# EAGLE design tc0xC_proto (EAGLE 9.6.2)

## Sheet 1 of 2
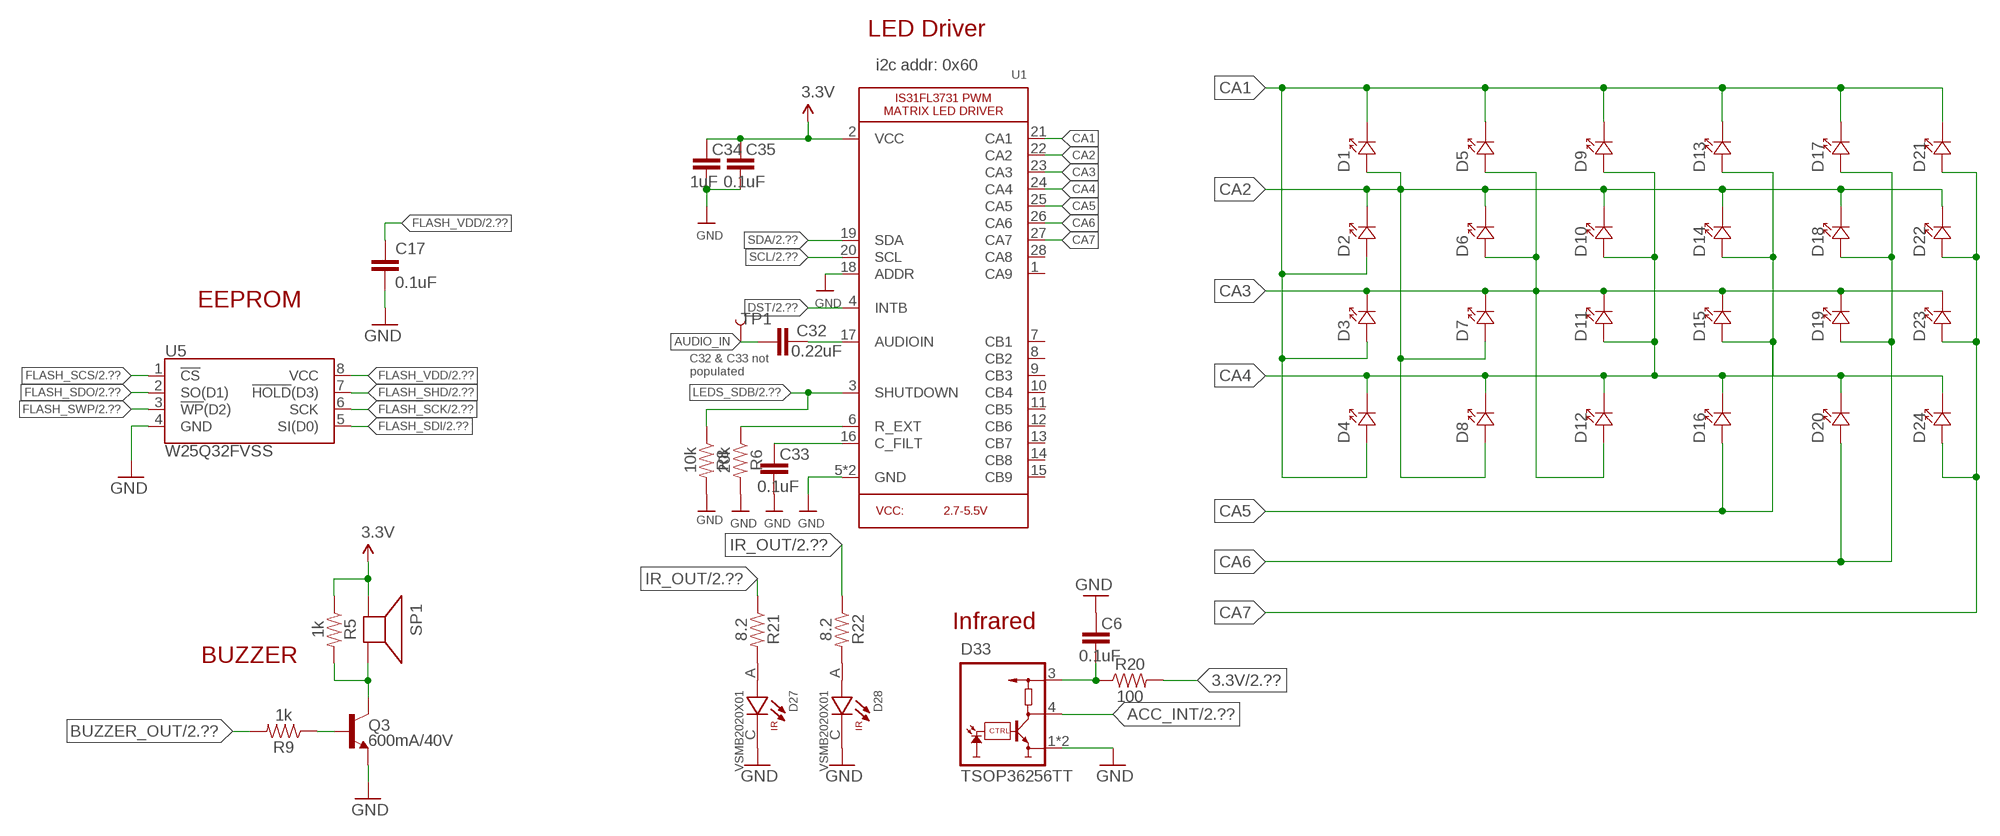
[diagram p0: schematic, sheet 1]

### Parts
C6  0.1uF  10PF-0603-50V-5%  [0603]
C17  0.1uF  0.1UF-0603-25V-(+80/-20%)  [0603]
C32  0.22uF  10PF-0603-50V-5%  [0603]
C33  0.1uF  10PF-0603-50V-5%  [0603]
C34  1uF  10PF-0603-50V-5%  [0603]
C35  0.1uF  10PF-0603-50V-5%  [0603]
D1  LED-603  [SMD-603]
D2  LED-603  [SMD-603]
D3  LED-603  [SMD-603]
D4  LED-603  [SMD-603]
D5  LED-603  [SMD-603]
D6  LED-603  [SMD-603]
D7  LED-603  [SMD-603]
D8  LED-603  [SMD-603]
D9  LED-603  [SMD-603]
D10  LED-603  [SMD-603]
D11  LED-603  [SMD-603]
D12  LED-603  [SMD-603]
D13  LED-603  [SMD-603]
D14  LED-603  [SMD-603]
D15  LED-603  [SMD-603]
D16  LED-603  [SMD-603]
D17  LED-603  [SMD-603]
D18  LED-603  [SMD-603]
D19  LED-603  [SMD-603]
D20  LED-603  [SMD-603]
D21  LED-603  [SMD-603]
D22  LED-603  [SMD-603]
D23  LED-603  [SMD-603]
D24  LED-603  [SMD-603]
D27  VSMB2020X01  [DIO_VSMB2020X01]
D28  VSMB2020X01  [DIO_VSMB2020X01]
D33  TSOP36256TT  [TSOP36256]
Q3  600mA/40V  TRANS_NPN-MMBT2222AL  [SOT23-3]
R5  1k  10KOHM-0603-1/10W-1%  [0603]
R6  20k  10KOHM-0603-1/10W-1%  [0603]
R8  10k  10KOHM-0603-1/10W-1%  [0603]
R9  1k  10KOHM-0603-1/10W-1%  [0603]
R20  100  10KOHM-0603-1/10W-1%  [0603]
R21  8.2  10KOHM-0603-1/10W-1%  [0603]
R22  8.2  10KOHM-0603-1/10W-1%  [0603]
SP1  SPEAKER/PS12  [PS12]
TP1  TEST-POINT3X5  [PAD.03X.05]
U1  IS31FL3731QFN  [QFN-28_4MM_0.4MM]
U5  W25Q32FVSS  [SOIC-8]

### Nets
3.3V: C6.2 C34.1 C35.1 D33.3(VS) R5.1 R20.1 R20.2 SP1.P$1(+) U1.2(VCC) ; also sheet 2
ACC_INT: D33.4(OUT) ; also sheet 2
AUDIO_IN: C32.1 TP1.P$1
BUZZER_OUT: R9.2 ; also sheet 2
CA1: D1.P$2(CATHODE-) D2.P$1(ANODE+) D3.P$1(ANODE+) D4.P$1(ANODE+) D5.P$2(CATHODE-) D9.P$2(CATHODE-) D13.P$2(CATHODE-) D17.P$2(CATHODE-) D21.P$2(CATHODE-) U1.21(CA1)
CA2: D1.P$1(ANODE+) D2.P$2(CATHODE-) D6.P$2(CATHODE-) D7.P$1(ANODE+) D8.P$1(ANODE+) D10.P$2(CATHODE-) D14.P$2(CATHODE-) D18.P$2(CATHODE-) D22.P$2(CATHODE-) U1.22(CA2)
CA3: D3.P$2(CATHODE-) D5.P$1(ANODE+) D6.P$1(ANODE+) D7.P$2(CATHODE-) D11.P$2(CATHODE-) D12.P$1(ANODE+) D15.P$2(CATHODE-) D19.P$2(CATHODE-) D23.P$2(CATHODE-) U1.23(CA3)
CA4: D4.P$2(CATHODE-) D8.P$2(CATHODE-) D9.P$1(ANODE+) D10.P$1(ANODE+) D11.P$1(ANODE+) D12.P$2(CATHODE-) D16.P$2(CATHODE-) D20.P$2(CATHODE-) D24.P$2(CATHODE-) U1.24(CA4)
CA5: D13.P$1(ANODE+) D14.P$1(ANODE+) D15.P$1(ANODE+) D16.P$1(ANODE+) U1.25(CA5)
CA6: D17.P$1(ANODE+) D18.P$1(ANODE+) D19.P$1(ANODE+) D20.P$1(ANODE+) U1.26(CA6)
CA7: D21.P$1(ANODE+) D22.P$1(ANODE+) D23.P$1(ANODE+) D24.P$1(ANODE+) U1.27(CA7)
DST: U1.4(INTB) ; also sheet 2
FLASH_SCK: U5.6(SCK) ; also sheet 2
FLASH_SCS: U5.1(!CS!) ; also sheet 2
FLASH_SDI: U5.5(SI(D0)) ; also sheet 2
FLASH_SDO: U5.2(SO(D1)) ; also sheet 2
FLASH_SHD: U5.7(!HOLD!(D3)) ; also sheet 2
FLASH_SWP: U5.3(!WP!(D2)) ; also sheet 2
FLASH_VDD: C17.1 U5.8(VCC) ; also sheet 2
GND: C6.1 C17.2 C33.2 C34.2 C35.2 D27.C D28.C D33.1(GND) D33.2(GND) Q3.2(E) R6.2 R8.2 U1.5(GND) U1.18(ADDR) U1.THERMAL(GND) U5.4(GND) ; also sheet 2
IR_OUT: R21.1 R22.1 ; also sheet 2
LEDS_SDB: R8.1 U1.3(SHUTDOWN) ; also sheet 2
N$1: C33.1 U1.16(C_FILT)
N$2: R6.1 U1.6(R_EXT)
N$3: Q3.3(C) R5.2 SP1.P$2(-)
N$5: D27.A R21.2
N$6: D28.A R22.2
N$11: C32.2 U1.17(AUDIOIN)
N$26: Q3.1(B) R9.1
SCL: U1.20(SCL) ; also sheet 2
SDA: U1.19(SDA) ; also sheet 2
Unconnected: U1.1(CA9) U1.7(CB1) U1.8(CB2) U1.9(CB3) U1.10(CB4) U1.11(CB5) U1.12(CB6) U1.13(CB7) U1.14(CB8) U1.15(CB9) U1.28(CA8)

### Notes on the sheet
- LED Driver
- i2c addr: 0x60
- EEPROM
- C32 & C33 not
  populated
- Infrared
- BUZZER

## Sheet 2 of 2
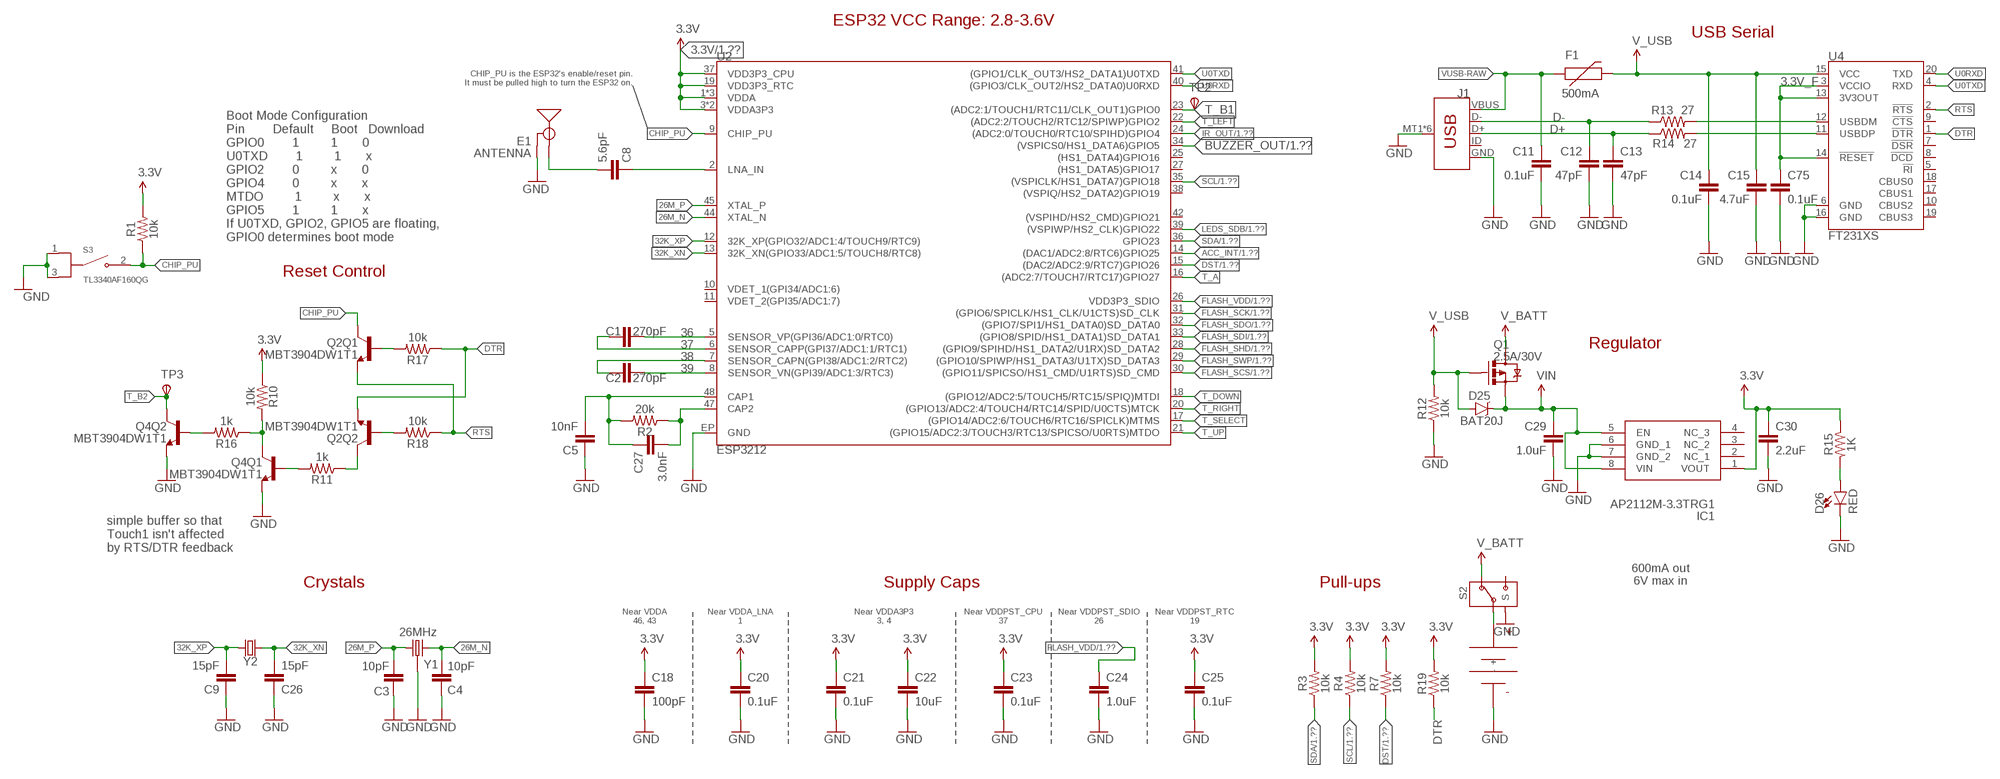
[diagram p1: schematic, sheet 2]

### Parts
C1  270pF  270PF-50V-5%(0603)  [0603]
C2  270pF  270PF-50V-5%(0603)  [0603]
C3  10pF  10PF-0603-50V-5%  [0603]
C4  10pF  10PF-0603-50V-5%  [0603]
C5  10nF  10NF-0603-50V-10%  [0603]
C8  5.6pF  5.6PF-50V-5%(0603)  [0603]
C9  15pF  15PF-0603-50V-5%  [0603]
C11  0.1uF  0.1UF-0603-25V-(+80/-20%)  [0603]
C12  47pF  47PF-0603-50V-5%  [0603]
C13  47pF  47PF-0603-50V-5%  [0603]
C14  0.1uF  0.1UF-0603-25V-(+80/-20%)  [0603]
C15  4.7uF  0.1UF-0603-25V-(+80/-20%)  [0603]
C18  100pF  100PF-0603-50V-5%  [0603]
C20  0.1uF  0.1UF-0603-25V-(+80/-20%)  [0603]
C21  0.1uF  0.1UF-0603-25V-(+80/-20%)  [0603]
C22  10uF  10UF-0603-6.3V-20%  [0603]
C23  0.1uF  0.1UF-0603-25V-(+80/-20%)  [0603]
C24  1.0uF  1.0UF-0603-16V-10%  [0603]
C25  0.1uF  0.1UF-0603-25V-(+80/-20%)  [0603]
C26  15pF  15PF-0603-50V-5%  [0603]
C27  3.0nF  3.0NF-0603-50V-5%  [0603]
C29  1.0uF  1.0UF-0805-25V-(+80/-20%)  [0805]
C30  2.2uF  2.2UF-0603-10V-20%  [0603]
C75  0.1uF  0.1UF-0603-25V-(+80/-20%)  [0603]
D25  BAT20J  DIODE-SCHOTTKY-BAT20J  [SOD-323]
D26  RED  LED-RED0603  [LED-0603@1]
E1  ANTENNA  ANTENNATRACE-TUNED  [TRACE_ANTENNA_2.4GHZ_25.7MM_TUNED]
F1  500mA  PTCSMD  [PTC-1206]
G2  KEYSTONE_2479  [KEYSTONE_2479]
IC1  AP2112M-3.3TRG1  [SOIC127P600X170-8N]
J1  USB_MICRO-B  [USB-MICROB-10118192]
Q1  2.5A/30V  MOSFET-PCHANNELDMG2307L  [SOT23-3@1]
Q2  MBT3904DW1T1  [SC70-6]
Q4  MBT3904DW1T1  [SC70-6]
R1  10k  10KOHM-1/10W-1%(0603)0603  [0603]
R2  20k  20KOHM-0603-1/10W-1%  [0603]
R3  10k  10KOHM-0603-1/10W-1%  [0603]
R4  10k  10KOHM-0603-1/10W-1%  [0603]
R7  10k  10KOHM-0603-1/10W-1%  [0603]
R10  10k  10KOHM-0603-1/10W-1%  [0603]
R11  1k  10KOHM-0603-1/10W-1%  [0603]
R12  10k  10KOHM-0603-1/10W-1%  [0603]
R13  27  27OHM1/10W1%(0603)0603-RES  [0603]
R14  27  27OHM1/10W1%(0603)0603-RES  [0603]
R15  1K  1KOHM-1/10W-1%(0603)  [0603]
R16  1k  10KOHM-0603-1/10W-1%  [0603]
R17  10k  10KOHM-0603-1/10W-1%  [0603]
R18  10k  10KOHM-0603-1/10W-1%  [0603]
R19  10k  10KOHM-0603-1/10W-1%  [0603]
S2  CUS-12B  [CUS-12_SPDT]
S3  TL3340AF160QG  [SW_TL3340AF160QG]
TP2  TPSTP08R  [TP08R]
TP3  TPSTP08R  [TP08R]
U2  ESP3212  [QFN48-0.4MM]
U4  FT231XS  [SSOP20_L]
Y1  26MHz  CRYSTAL-GROUNDED3.2X2.5  [CRYSTAL-SMD-3.2X2.5]
Y2  32.768kHz  FC-12M  [FC-12M]

### Nets
3.3V: C18.1 C20.1 C21.1 C22.1 C23.1 C25.1 C30.1 IC1.1(VOUT) R1.2 R3.2 R4.2 R7.2 R10.1 R15.1 R19.2 U2.1(VDDA) U2.3(VDDA3P3) U2.4(VDDA3P3) U2.19(VDD3P3_RTC) U2.37(VDD3P3_CPU) U2.43(VDDA) U2.46(VDDA) ; also sheet 1
3.3V_F: C75.1 U4.3(VCCIO) U4.13(3V3OUT) U4.14(!RESET)
26M_N: C4.2 U2.44(XTAL_N) Y1.3
26M_P: C3.2 U2.45(XTAL_P) Y1.1
32K_XN: C26.2 U2.13(32K_XN(GPIO33/ADC1:5/TOUCH8/RTC8)) Y2.2
32K_XP: C9.2 U2.12(32K_XP(GPIO32/ADC1:4/TOUCH9/RTC9)) Y2.1
36: C1.2 U2.5(SENSOR_VP(GPI36/ADC1:0/RTC0))
37: C1.1 U2.6(SENSOR_CAPP(GPI37/ADC1:1/RTC1))
38: C2.1 U2.7(SENSOR_CAPN(GPI38/ADC1:2/RTC2))
39: C2.2 U2.8(SENSOR_VN(GPI39/ADC1:3/RTC3))
ACC_INT: U2.14((DAC1/ADC2:8/RTC6)GPIO25) ; also sheet 1
BUZZER_OUT: U2.34((VSPICS0/HS1_DATA6)GPIO5) ; also sheet 1
CAP_10N: C5.2 C27.1 R2.2 U2.48(CAP1)
CHIP_PU: Q2.3(Q1:C) R1.1 S3.2(NO) U2.9(CHIP_PU)
D+: C13.1 J1.D+ R14.1
D-: C12.1 J1.D- R13.1
DST: R7.1 U2.15((DAC2/ADC2:9/RTC7)GPIO26) ; also sheet 1
DTR: Q2.1(Q2:E) R17.1 R19.1 U4.1(!DTR)
FLASH_SCK: U2.31((GPIO6/SPICLK/HS1_CLK/U1CTS)SD_CLK) ; also sheet 1
FLASH_SCS: U2.30((GPIO11/SPICSO/HS1_CMD/U1RTS)SD_CMD) ; also sheet 1
FLASH_SDI: U2.33((GPIO8/SPID/HS1_DATA1)SD_DATA1) ; also sheet 1
FLASH_SDO: U2.32((GPIO7/SPI1/HS1_DATA0)SD_DATA0) ; also sheet 1
FLASH_SHD: U2.28((GPIO9/SPIHD/HS1_DATA2/U1RX)SD_DATA2) ; also sheet 1
FLASH_SWP: U2.29((GPIO10/SPIWP/HS1_DATA3/U1TX)SD_DATA3) ; also sheet 1
FLASH_VDD: C24.1 U2.26(VDD3P3_SDIO) ; also sheet 1
GND: C3.1 C4.1 C5.1 C9.1 C11.2 C12.2 C13.2 C14.2 C15.2 C18.2 C20.2 C21.2 C22.2 C23.2 C24.2 C25.2 C26.1 C29.2 C30.2 C75.2 D26.C E1.GND E1.GND2(GND) G2.- IC1.6(GND_1) IC1.7(GND_2) J1.GND J1.MT1(SHIELD) J1.MT2(SHIELD) J1.MT3(SHIELD) J1.MT4(SHIELD) J1.P$1(SHIELD) J1.P$2(SHIELD) Q4.1(Q2:E) Q4.4(Q1:E) R12.1 S2.P$4(S) S2.P$5(S) S2.P$6(S) S2.P$7(S) S3.1(COM_1) S3.3(COM_2) U2.EP(GND) U4.6(GND) U4.16(GND) Y1.2(GND) Y1.4(GND) ; also sheet 1
IR_OUT: U2.24((ADC2:0/TOUCH0/RTC10/SPIHD)GPIO4) ; also sheet 1
LEDS_SDB: U2.39((VSPIWP/HS2_CLK)GPIO22) ; also sheet 1
LNA_IN: C8.1 U2.2(LNA_IN)
N$4: C27.2 R2.1 U2.47(CAP2)
N$7: R13.2 U4.12(USBDM)
N$8: R14.2 U4.11(USBDP)
N$9: Q4.2(Q2:B) R16.2
N$10: Q2.5(Q1:B) R17.2
N$12: Q2.2(Q2:B) R18.2
N$13: Q4.3(Q1:C) R10.2 R16.1
N$14: Q4.5(Q1:B) R11.2
N$15: Q2.6(Q2:C) R11.1
N$16: G2.+ S2.P$2
N$18: D26.A R15.2
RTS: Q2.4(Q1:E) R18.1 U4.2(!RTS)
SCL: R4.1 U2.35((VSPICLK/HS1_DATA7)GPIO18) ; also sheet 1
SDA: R3.1 U2.36(GPIO23) ; also sheet 1
T_A: U2.16((ADC2:7/TOUCH7/RTC17)GPIO27)
T_B1: TP2.TP(PP) U2.23((ADC2:1/TOUCH1/RTC11/CLK_OUT1)GPIO0)
T_B2: Q4.6(Q2:C) TP3.TP(PP)
T_DOWN: U2.18((GPIO12/ADC2:5/TOUCH5/RTC15/SPIQ)MTDI)
T_LEFT: U2.22((ADC2:2/TOUCH2/RTC12/SPIWP)GPIO2)
T_RIGHT: U2.20((GPIO13/ADC2:4/TOUCH4/RTC14/SPID/U0CTS)MTCK)
T_SELECT: U2.17((GPIO14/ADC2:6/TOUCH6/RTC16/SPICLK)MTMS)
T_UP: U2.21((GPIO15/ADC2:3/TOUCH3/RTC13/SPICSO/U0RTS)MTDO)
TRACE_ANT: C8.2 E1.ANT(SIGNAL)
U0RXD: U2.40((GPIO3/CLK_OUT2/HS2_DATA0)U0RXD) U4.20(TXD)
U0TXD: U2.41((GPIO1/CLK_OUT3/HS2_DATA1)U0TXD) U4.4(RXD)
V_BATT: Q1.3(D) S2.P$1
V_USB: C14.1 C15.1 D25.A F1.2 Q1.1(G) R12.2 U4.15(VCC)
VIN: C29.1 D25.C IC1.5(EN) IC1.8(VIN) Q1.2(S)
VUSB-RAW: C11.1 F1.1 J1.VBUS
Unconnected: IC1.2(NC_1) IC1.3(NC_2) IC1.4(NC_3) J1.ID S2.P$3 U2.10(VDET_1(GPI34/ADC1:6)) U2.11(VDET_2(GPI35/ADC1:7)) U2.25((HS1_DATA4)GPIO16) U2.27((HS1_DATA5)GPIO17) U2.38((VSPIQ/HS2_DATA2)GPIO19) U2.42((VSPIHD/HS2_CMD)GPIO21) U4.5(!RI) U4.7(!DSR) U4.8(!DCD) U4.9(!CTS) U4.10(CBUS2) U4.17(CBUS1) U4.18(CBUS0) U4.19(CBUS3)

### Notes on the sheet
- ESP32 VCC Range: 2.8-3.6V
- USB Serial
- CHIP_PU is the ESP32's enable/reset pin.
  It must be pulled high to turn the ESP32 on.
- Boot Mode Configuration
  Pin        Default     Boot   Download
  GPIO0        1         1       0
  U0TXD        1         1       x
  GPIO2        0         x       0
  GPIO4        0         x       x
  MTDO         1         x       x
  GPIO5        1         1       x
  If U0TXD, GPIO2, GPIO5 are floating, 
  GPIO0 determines boot mode
- Reset Control
- Regulator
- simple buffer so that
  Touch1 isn't affected
  by RTS/DTR feedback
- 600mA out
  6V max in
- Crystals | Supply Caps | Pull-ups
- Near VDDA
  46, 43
- Near VDDA_LNA
  1
- Near VDDA3P3
  3, 4
- Near VDDPST_CPU
  37
- Near VDDPST_SDIO
  26
- Near VDDPST_RTC
  19

## Library data of the parts
C1 C2 = esp32-thing-temp:270PF-50V-5%(0603): CAP-13339; PROD_ID: CAP-13339
C3 C4 = SparkFun-Capacitors:10PF: 10pF ceramic capacitors A capacitor is a passive two-terminal electrical component used to store electrical energy temporarily in an electric field.; PROD_ID: CAP-11812
C5 = SparkFun-Capacitors:10NF: 0.01uF/10nF/10,000pF ceramic capacitors A capacitor is a passive two-terminal electrical component used to store electrical energy temporarily in an electric field. CAP-09321; PROD_ID: CAP-00867
C6 C32-C35 = SparkFun-Capacitors:10PF: 10pF ceramic capacitors A capacitor is a passive two-terminal electrical component used to store electrical energy temporarily in an electric field.; PROD_ID: CAP-11812; VALUE: 10pF
C8 = esp32-thing-temp:5.6PF-50V-5%(0603): CAP-12456; PROD_ID: CAP-12456
C9 C26 = SparkFun-Capacitors:15PF: 15pF ceramic capacitors A capacitor is a passive two-terminal electrical component used to store electrical energy temporarily in an electric field.; PROD_ID: CAP-07881
C11 C14 C17 C20 C21 C23 C25 C75 = SparkFun-Capacitors:0.1UF: 0.1µF ceramic capacitors A capacitor is a passive two-terminal electrical component used to store electrical energy temporarily in an electric field.; PROD_ID: CAP-00810
C12 C13 = SparkFun-Capacitors:47PF: 47pF ceramic capacitors A capacitor is a passive two-terminal electrical component used to store electrical energy temporarily in an electric field.; PROD_ID: CAP-08913
C15 = SparkFun-Capacitors:0.1UF: 0.1µF ceramic capacitors A capacitor is a passive two-terminal electrical component used to store electrical energy temporarily in an electric field.; PROD_ID: CAP-00810; VALUE: 0.1uF
C18 = SparkFun-Capacitors:100PF: 100pF/0.1nF ceramic capacitors A capacitor is a passive two-terminal electrical component used to store electrical energy temporarily in an electric field.; PROD_ID: CAP-07883
C22 = SparkFun-Capacitors:10UF: 10.0µF ceramic capacitors A capacitor is a passive two-terminal electrical component used to store electrical energy temporarily in an electric field.; PROD_ID: CAP-11015
C24 = SparkFun-Capacitors:1.0UF: 1µF ceramic capacitors A capacitor is a passive two-terminal electrical component used to store electrical energy temporarily in an electric field.; PROD_ID: CAP-00868
C27 = esp32-thing-temp:3.0NF: 3.0nF (3nF, 3000pF) ceramic capacitors A capacitor is a passive two-terminal electrical component used to store electrical energy temporarily in an electric field.; PROD_ID: CAP-13515
C29 = SparkFun-Capacitors:1.0UF: 1µF ceramic capacitors A capacitor is a passive two-terminal electrical component used to store electrical energy temporarily in an electric field.; PROD_ID: CAP-11625
C30 = SparkFun-Capacitors:2.2UF: 2.2µF ceramic capacitors A capacitor is a passive two-terminal electrical component used to store electrical energy temporarily in an electric field.; PROD_ID: CAP-07888
D1-D24 = Rob-Diodes:LED
D25 = SparkFun-DiscreteSemi:DIODE-SCHOTTKY: Schottky diodes in SFE's production catalog BAT20J 1A 23V 0.62Vf RB751 120mA 40V 0.37Vf PMEG4005EJ 0.5A 40V 0.42Vf MBRA140 1A 40V 0.5Vf B340A 3A 40V SMA; PROD_ID: DIO-11623
D26 = SparkFun-LED:LED-RED: Red SMD LED Used in manufacturing of most products at SparkFun 0603 - SMD 0603 package Forward Voltage: 1.9V Forward Current: 20mA Datasheet: [Product Link] <http://docs.avagotech.com/docs/AV02-0551EN> 0603 SMART - SMD 0603 SMART package ( more efficient and expensive) Forward Voltage: 1.8V Forward Current: 20mA Datasheet: [Product Link] <http://www.osram-os.com/Graphics/XPic2/00077099_0.pdf> 1206 - SMD 1206 package Forward Voltage: 2V Forward Current: 20mA Datasheet: [Product Link] <https://www.sparkfun.com/datasheets/DevTools/LilyPad/Q150OVS4.pdff> 1206 LilyPad - SMD 1206 LilyPad package Forward Voltage: 2V Forward Current: 20mA Datasheet: [Product Link] <https://www.sparkfun.com/datasheets/DevTools/LilyPad/Q150OVS4.pdf>; PROD_ID: DIO-00819
D27 D28 = VSMB2020X01:VSMB2020X01: 940 nm 100 mA ±12° Surface Mount High Speed Infrared Emitting Diode T&R Check availability <https://pricing.snapeda.com/parts/VSMB2020X01/Vishay%20Semiconductors/view-part?ref=eda>; AVAILABILITY: In Stock; DESCRIPTION: Infrared (IR) Emitter 940nm 1.35V 100mA 20mW/sr @ 100mA 24° 2-SMD, Gull Wing; MF: Vishay Semiconductors; MP: VSMB2020X01; PACKAGE: None; PRICE: None; PURCHASE-URL: https://pricing.snapeda.com/search/part/VSMB2020X01/?ref=eda
D33 = TSOP36256:TSOP36256: Récepteur Infrarouge 56khz 35m 45° Doc constructeur <http://geii/magasin/pdf/TSOP36256.pdf> GEII/IUT ANGERS Check availability <https://pricing.snapeda.com/parts/TSOP36256/Vishay%20Semiconductors/view-part?ref=eda>; AVAILABILITY: In Stock; DESCRIPTION: IR RCVR, 35M, 0.12MW/M2, TOP/SIDE SMD; Carrier Frequency:56kHz; IR Receiver Mounting Style:Top or Side View Surface Mount; Remote Control Code:NEC (Repetitive Pulse), NEC (Repetitive Data), Toshiba Micom Format, Sharp, RC-5, RC-6, R-2000, Sony; Transmission Range:35m; Automatic Gain Control (AGC) Type:AGC2; Detection Threshold / Sensitivity:0.12mW/m²; Directivity:45°; Supply Voltage Max:5.5V; Supply Voltage Min:2.7V; Operating Temperature Min:-25°C; Operating Temperature Max:85°C; Supply Current:1.3mA; Product Range:-; No. of Pins:4Pins; Operating Temperature Range:-25°C to +85°C; Supply Voltage Range:2.7V to 5.5V; Viewing Angle:45°; MF: Vishay Semiconductors; MP: TSOP36256; PACKAGE: None; PRICE: None; PURCHASE-URL: https://pricing.snapeda.com/search/part/TSOP36256/?ref=eda
E1 = esp32-thing-temp:ANTENNA: Chip antenna Chip antenna with ground or secondary connection. Common with larger metal RF connectors.
F1 = SparkFun-PowerIC:PTC: Resettable Fuse PTC Resettable Fuse. Spark Fun Electronics SKU : COM-08357; PROD_ID: RES-11150
G2 = keystone:KEYSTONE_2479
IC1 = AP2112M-3.3TRG1:AP2112M-3.3TRG1: LDO Voltage Regulators LDO CMOS HiCurr Source: Datasheet <https://www.diodes.com/assets/Datasheets/AP2112.pdf>; ARROW_PART_NUMBER: AP2112M-3.3TRG1; ARROW_PRICE-STOCK: https://www.arrow.com/en/products/ap2112m-3.3trg1/diodes-incorporated?region=nac; DESCRIPTION: LDO Voltage Regulators LDO CMOS HiCurr; HEIGHT: 1.7mm; MANUFACTURER_NAME: Diodes Inc.; MANUFACTURER_PART_NUMBER: AP2112M-3.3TRG1; MOUSER_PART_NUMBER: 621-AP2112M-3.3TRG1; MOUSER_PRICE-STOCK: https://www.mouser.co.uk/ProductDetail/Diodes-Incorporated/AP2112M-33TRG1?qs=5V6w%252Be2aIqa1YM8VADFBsQ%3D%3D
J1 = SparkFun-Connectors-new:USB_MICRO-B: USB Type Micro-B Connector Male/female and PTH/SMT variants SparkFun Products: SparkFun microB USB Breakout <https://www.sparkfun.com/products/12035> SparkFun USB microB Plug Breakout <https://www.sparkfun.com/products/10031> SparkFun ESP8266 Thing <https://www.sparkfun.com/products/13231>
Q1 = SparkFun-DiscreteSemi:MOSFET-PCHANNEL: Generic PMOSFET IRLML2244 - TRANS-11153 (SOT-23 -20V -4.3A) (1.Gate 2.Source 3.Drain) FQP27P06 - COM-10349 <http://www.sparkfun.com/products/10349> (TO-220 -60V -27A) (1.Gate 2.Source 3.Drain); PROD_ID: TRANS-11308
Q2 Q4 = esp32-thing-temp:MBT3904DW1T1: MBT3904DW1 Dual NPN Transistors The MBT3904W1 puts two general purpose 3904 NPN transistors in a single package. Datasheet <http://www.onsemi.com/pub_link/Collateral/MBT3904DW1T1-D.PDF>; PROD_ID: TRANS-13337
Q3 = SparkFun-DiscreteSemi:TRANS_NPN: NPN transistor Current controlled devices typically used to amplify current or used as a switch. BC547 - COM-08928 <http://www.sparkfun.com/products/8928> (TO-92 45V 100mA) (1.Collector 2.Base 3.Emitter) 2N3904 - COM-00521 <http://www.sparkfun.com/products/521> (TO-92 40V 200mA) (1.Emitter 2.Base 3.Collector) P2N2222A - COM-12852 <http://www.sparkfun.com/products/12852> (TO-92 40V 600mA) (1.Collector 2.Base 3.Emitter); PROD_ID: TRANS-08049
R1 = SparkFun-Resistors:10KOHM-1/10W-1%(0603): RES-00824; PROD_ID: RES-00824; VALUE: 10K
R2 = SparkFun-Resistors:20KOHM: 20kΩ resistor A resistor is a passive two-terminal electrical component that implements electrical resistance as a circuit element. Resistors act to reduce current flow, and, at the same time, act to lower voltage levels within circuits. - Wikipedia; PROD_ID: RES-09383
R3 R4 R7 R8 R10 R12 R17-R19 = SparkFun-Resistors:10KOHM: 10kΩ resistor A resistor is a passive two-terminal electrical component that implements electrical resistance as a circuit element. Resistors act to reduce current flow, and, at the same time, act to lower voltage levels within circuits. - Wikipedia; PROD_ID: RES-00824
R5 R6 R9 R11 R16 R20-R22 = SparkFun-Resistors:10KOHM: 10kΩ resistor A resistor is a passive two-terminal electrical component that implements electrical resistance as a circuit element. Resistors act to reduce current flow, and, at the same time, act to lower voltage levels within circuits. - Wikipedia; PROD_ID: RES-00824; VALUE: 10k
R13 R14 = SparkFun-Resistors:27OHM1/10W1%(0603): RES-09334; PROD_ID: RES-09334
R15 = SparkFun-Resistors:1KOHM-1/10W-1%(0603): RES-07856; PROD_ID: RES-07856
S2 = IDEO-Switches:CUS-12B
S3 = TL3340AF160QG:TL3340AF160QG: Check availability <https://pricing.snapeda.com/parts/TL3340AF160QG/E-Switch/view-part?ref=eda> Check availability <https://pricing.snapeda.com/parts/TL3340AF160QG/E-Switch/view-part?ref=eda>; AVAILABILITY: In Stock; DESCRIPTION: Tactile Switch SPST-NO Side Actuated Surface Mount, Right Angle; MF: E-Switch; MP: TL3340AF160QG; PACKAGE: None; PRICE: None; PURCHASE-URL: https://pricing.snapeda.com/search/part/TL3340AF160QG/?ref=eda
SP1 = adafruit:SPEAKER: SPEAKER Source: Buerklin Added PS12 (for part # PS1240 piezo) http://www.ladyada.net/library/pcb/eaglelibrary.html
TP1 = SparkFun-Connectors:TEST-POINT: SparkFun Test Points Bare copper test points for troubleshooting or In-Circuit-Testing. These are used by our Production team for verifying production board runs using pogo-pins on test beds. SparkFun Products: SparkFun LSM9DS1 Breakout <https://www.sparkfun.com/products/13284> SparkFun PSOC <https://www.sparkfun.com/products/13714> SparkFun Load Cell Amplifier <https://www.sparkfun.com/products/13879>
TP2 TP3 = testpad:TPS: TEST PIN
U1 = IDEO-ICs:IS31FL3731: IS31FL3731 PWM LED Matrix Driver
U2 = esp32-thing-temp:ESP3212; PROD_ID: IC-13338
U4 = SparkFun-DigitalIC:FT231X: FTDI FT231X Full Speed USB to Full-handshake UART This USB2.0 Full Speed IC offers a compact bridge to full handshake UART interfaces. The device is a UART, capable of operating up to 3MBaud, with low power consumption (8mA). The FT231X includes the complete FT-X series feature set and enables USB to be added into a system design quickly and easily over a UART interface.; PROD_ID: IC-11524
U5 = SparkFun-DigitalIC:W25Q32FV: Winbond W25Q32FV 32Mbit (4MB) Flash The W25Q32FV support the standard Serial Peripheral Interface (SPI), Dual/Quad I/O SPI as well as 2-clocks instruction cycle Quad Peripheral Interface (QPI). Datasheet <http://www.winbond.com/resource-files/w25q32fv%20revh%20091613.pdf>; PROD_ID: IC-13229
Y1 = things:CRYSTAL-GROUNDED; PROD_ID: XTAL-12454
Y2 = crystal:FC-12M: kHz RANGE CRYSTAL UNIT LOW PROFILE SMD Source: Epson Toyocom FC-12M.pdf

## Board
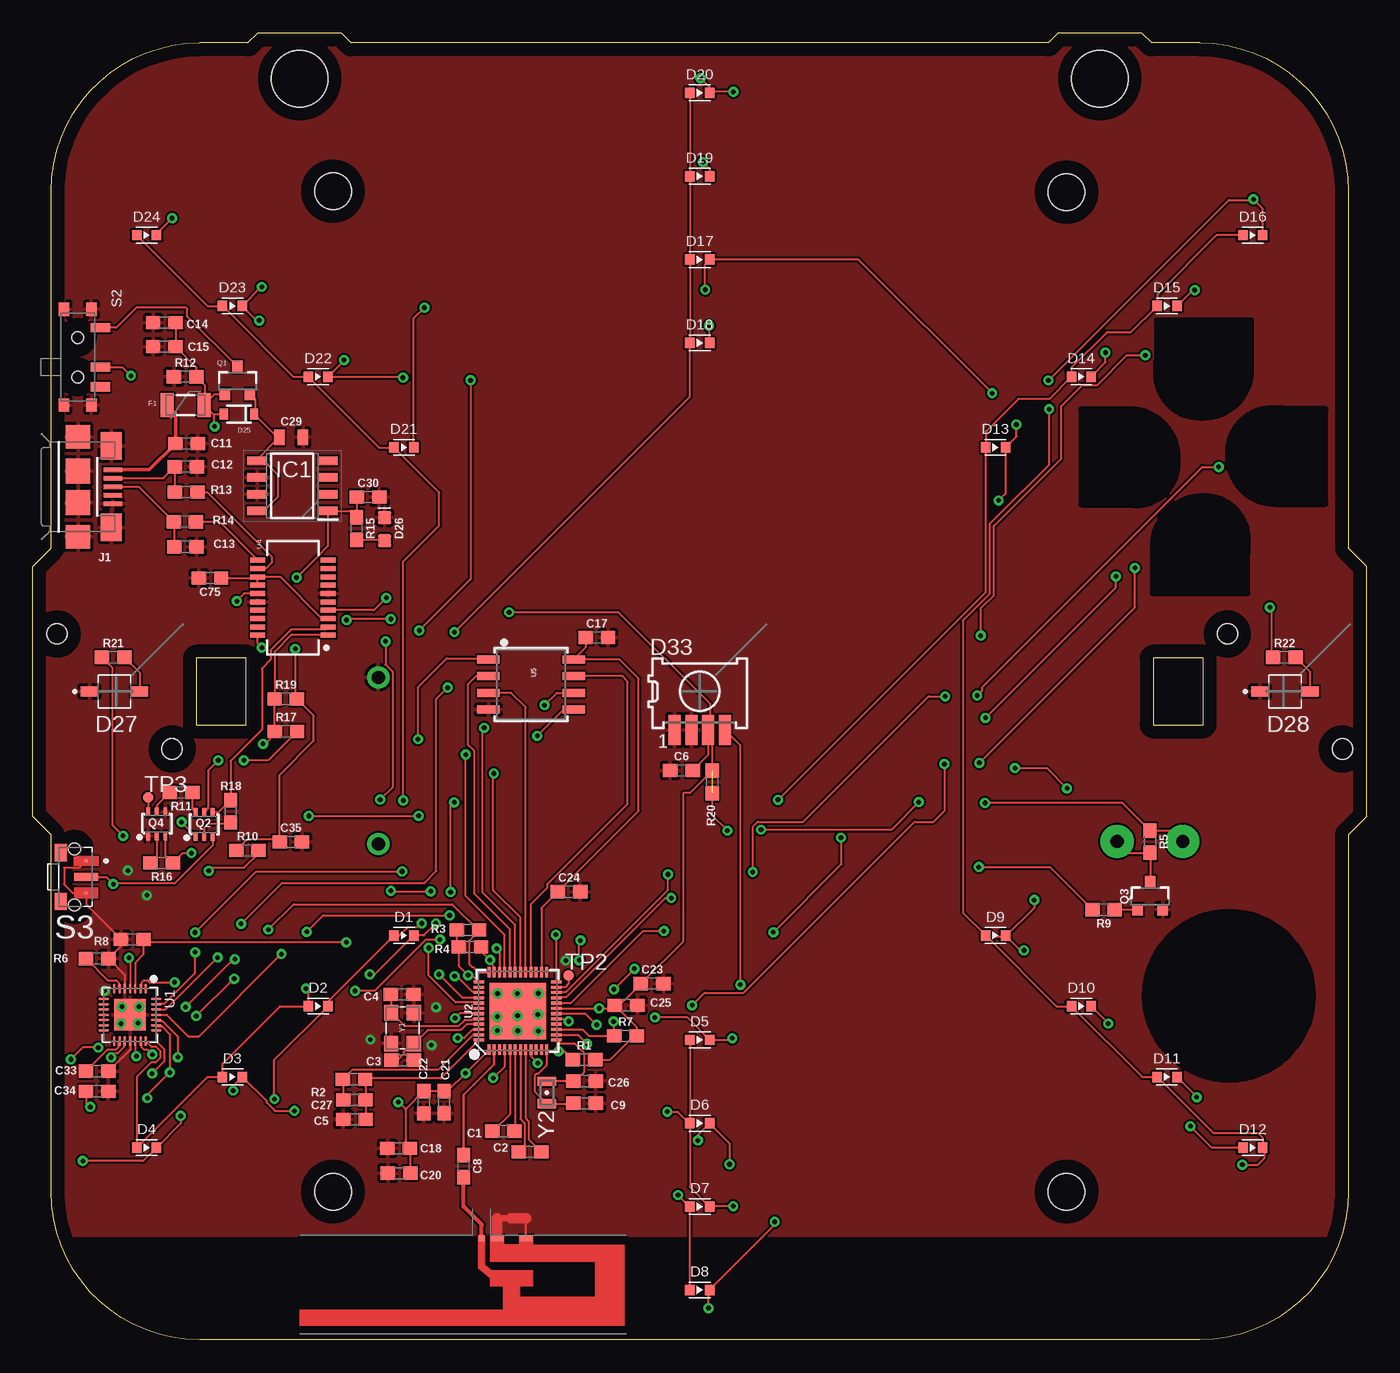
[diagram p2: board, top side]
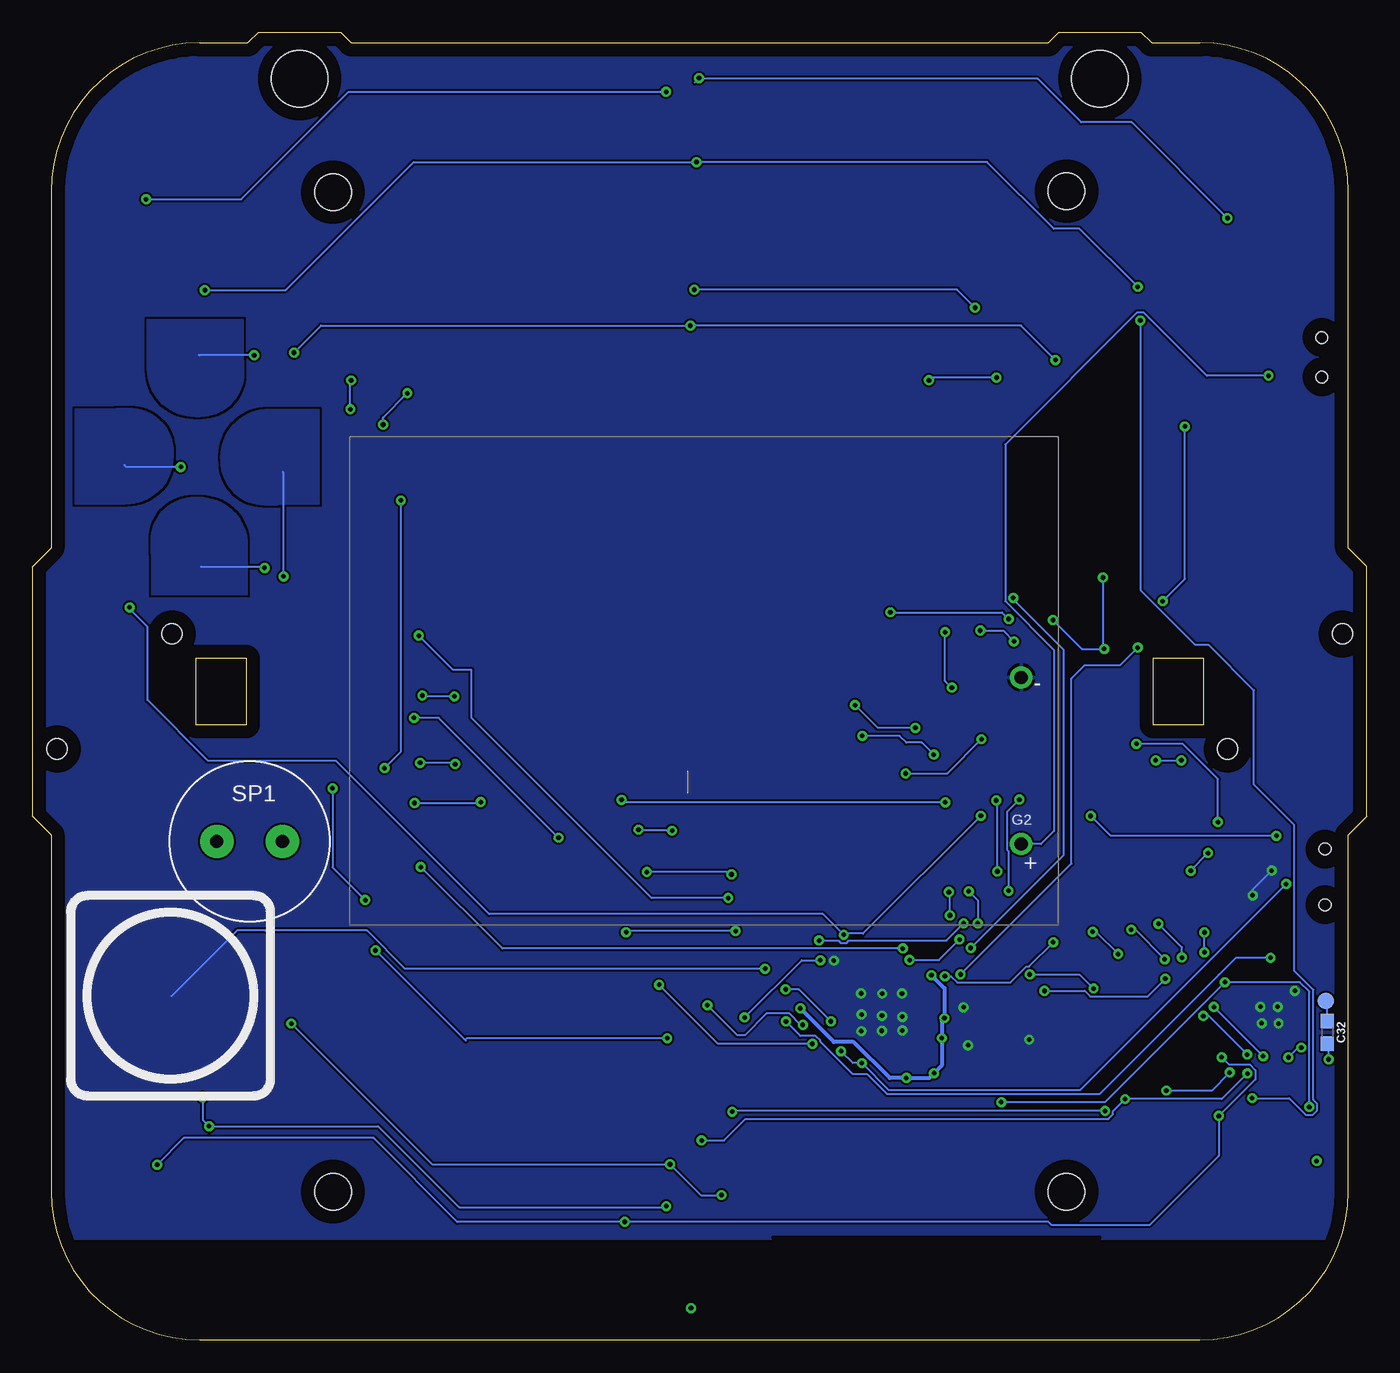
[diagram p3: board, bottom side, seen from below]

Size 101.6 x 99.57 mm. Coordinates in mm from the lower left corner, seen from the top.
Outline: 1.4,87.5 arc-90 12.7,98.81 16.38,98.81 17.14,99.57 23.5,99.57 24.26,98.81 77.34,98.81 78.11,99.57 84.45,99.57 85.22,98.81 88.9,98.81 arc-90 100.2,87.5 100.2,60.33 101.6,58.93 101.6,39.88 100.2,38.48 100.2,11.3 arc-90 88.9,0 12.7,0 arc-90 1.4,11.3 1.4,38.48 0,39.88 0,58.93 1.4,60.33 1.4,87.5
Outline: 85.34,46.86 89.15,46.86 89.15,51.94 85.34,51.94 85.34,46.86
Outline: 12.45,46.86 16.26,46.86 16.26,51.94 12.45,51.94 12.45,46.86
Copper layers (1*16): Top 0.035mm / dielectric 1.5mm / Bottom 0.035mm
Design rules "default": minimum track width 6mil, minimum drill 0.35mm, track to track 6mil, track to pad 6mil, pad to pad 6mil, via to via 6mil, smd to smd 6mil, copper to edge 40mil, drill to drill 6mil, minimum pad ring 10mil, minimum via ring 8mil, stop-mask expansion 4mil, vias tented up to drill 0mil, thermal gap 10mil
Holes 1.55 mm at 91,53.78 99.76,45.02 10.6,45.02 1.84,53.78
Holes 2.79 mm at 22.86,87.5 78.74,87.43 78.74,11.3 22.86,11.3
Holes 4.32 mm at 20.32,96.08 81.28,96.08
tKeepout: area 99,60.9 to 100.3,63; area 99,35.8 to 100.3,38; area 98.2,43.5 to 101.3,46.6; area 89.4,43.5 to 92.5,46.6; area 98.2,52.2 to 101.3,55.4; area 89.4,52.2 to 92.5,55.4; area 9,43.5 to 12.2,46.6; area 0.3,43.5 to 3.4,46.6; area 9,52.2 to 12.2,55.4; area 0.3,52.2 to 3.4,55.4; area 29.7,28.3 to 50.8,70.5; area 50.8,28.3 to 71.9,70.5; 56 more areas
tRestrict: area 84.8,19.9 to 97.5,32.6; area 85.3,56.9 to 92.6,64.3; area 79.9,63.6 to 87.2,70.9; area 85.5,70.3 to 92.8,77.7; area 91.1,63.7 to 98.5,70.9; area 91,63.7 to 98.4,70.9

### Footprints (pad centres in the part's own frame; a part is rotated, then mirrored left to right if it is on the bottom)
0603 = smd 1.1 x 1: 1 -0.85,0; 2 0.85,0
0805 = smd 0.8 x 1.2: 1 -0.9,0; 2 0.9,0
SMD-603 = smd 0.8 x 0.8: P$1 -0.75,0; P$2 0.75,0
SOD-323 = smd 0.63 x 0.83: A 1.15,0; C -1.15,0
LED-0603@1 = smd 1 x 1: A 0,-0.877; C 0,0.877
DIO_VSMB2020X01 = smd 1.35 x 0.75: A 1.9,0; C -1.9,0
TSOP36256 = smd 0.914 x 2.286: 1 -1.905,-2.921; 2 -0.635,-2.921; 3 0.635,-2.921; 4 1.905,-2.921
TRACE_ANTENNA_2.4GHZ_25.7MM_TUNED = smd 0.46 x 0.46: ANT 0,0.23 | smd 1 x 0.46: GND -1.18,0.23; GND2 -3.38,0.23
PTC-1206 = smd 1 x 1.8: 1 -1.4,0; 2 1.4,0
KEYSTONE_2479 = drill 1 pad 1.676: + 51.15,6.15; - 51.15,18.85
SOIC127P600X170-8N = smd 1.5 x 0.65: 1 -2.7,1.905; 2 -2.7,0.635; 3 -2.7,-0.635; 4 -2.7,-1.905; 5 2.7,-1.905; 6 2.7,-0.635; 7 2.7,0.635; 8 2.7,1.905
USB-MICROB-10118192 = smd 0.35 x 1.4: D+ 0,2.65; D- -0.65,2.65; GND 1.3,2.65; ID 0.65,2.65; VBUS -1.3,2.65 | smd 1.8 x 1.9: MT1 -3.8,0; MT2 3.8,0 | smd 2.1 x 1.6: MT3 -3.1,2.54; MT4 3.1,2.54 | smd 1.9 x 1.9: P$1 -1.2,0; P$2 1.2,0
SOT23-3@1 = smd 0.8 x 0.9: 1 -0.95,-1; 2 0.95,-1; 3 0,1.1
SC70-6 = smd 0.3 x 0.66: 1 -0.65,-0.92; 2 0,-0.92; 3 0.65,-0.92; 4 0.65,0.92; 5 0,0.92; 6 -0.65,0.92
SOT23-3 = smd 0.8 x 0.9: 1 -0.95,-1; 2 0.95,-1; 3 0,1.1
CUS-12_SPDT = smd 0.7 x 1.5: P$1 -2.25,1.75; P$2 0.75,1.75; P$3 2.25,1.75 | smd 1 x 0.8: P$4 -3.65,1.05; P$5 -3.65,-1.05; P$6 3.65,1.05; P$7 3.65,-1.05 | hole 0.9: -1.5,0; 1.5,0
SW_TL3340AF160QG = smd 0.2 x 0.2: 1 -1.225,0.9; 3 1.225,0.9 | smd 0.6 x 1.8: 2 0,0.9 | smd 1.3 x 0.9: S1 -1.85,-1.05; S2 1.85,-1.05 | hole 0.9: 2.125,0; -2.125,0
PS12 = drill 1 pad 2.54: P$1 -2.5,0; P$2 2.5,0
PAD.03X.05 = smd 1.27 x 1.27: P$1 0,0
TP08R = smd 0.8 x 0.8: TP 0,0
QFN-28_4MM_0.4MM = smd 0.8 x 0.2: 1 -2,1.2; 2 -2,0.8; 3 -2,0.4; 4 -2,0; 5 -2,-0.4; 6 -2,-0.8; 7 -2,-1.2; 15 2,-1.2; 16 2,-0.8; 17 2,-0.4; 18 2,0; 19 2,0.4; 20 2,0.8; 21 2,1.2 | smd 0.2 x 0.8: 8 -1.2,-2; 9 -0.8,-2; 10 -0.4,-2; 11 0,-2; 12 0.4,-2; 13 0.8,-2; 14 1.2,-2; 22 1.2,2; 23 0.8,2; 24 0.4,2; 25 0,2; 26 -0.4,2; 27 -0.8,2; 28 -1.2,2 | smd 2.4 x 2.4: THERMAL 0,0
QFN48-0.4MM = smd 0.8 x 0.23: 1 -2.95,2.2; 2 -2.95,1.8; 3 -2.95,1.4; 4 -2.95,1; 5 -2.95,0.6; 6 -2.95,0.2; 7 -2.95,-0.2; 8 -2.95,-0.6; 9 -2.95,-1; 10 -2.95,-1.4; 11 -2.95,-1.8; 12 -2.95,-2.2; 25 2.95,-2.2; 26 2.95,-1.8; 27 2.95,-1.4; 28 2.95,-1; 29 2.95,-0.6; 30 2.95,-0.2; 31 2.95,0.2; 32 2.95,0.6; 33 2.95,1; 34 2.95,1.4; 35 2.95,1.8; 36 2.95,2.2 | smd 0.23 x 0.8: 13 -2.2,-2.95; 14 -1.8,-2.95; 15 -1.4,-2.95; 16 -1,-2.95; 17 -0.6,-2.95; 18 -0.2,-2.95; 19 0.2,-2.95; 20 0.6,-2.95; 21 1,-2.95; 22 1.4,-2.95; 23 1.8,-2.95; 24 2.2,-2.95; 37 2.2,2.95; 38 1.8,2.95; 39 1.4,2.95; 40 1,2.95; 41 0.6,2.95; 42 0.2,2.95; 43 -0.2,2.95; 44 -0.6,2.95; 45 -1,2.95; 46 -1.4,2.95; 47 -1.8,2.95; 48 -2.2,2.95 | smd 4.3 x 4.3: EP 0,0
SSOP20_L = smd 0.381 x 1.143: 1 -2.857,-2.68; 2 -2.223,-2.68; 3 -1.587,-2.68; 4 -0.953,-2.68; 5 -0.318,-2.68; 6 0.318,-2.68; 7 0.953,-2.68; 8 1.587,-2.68; 9 2.223,-2.68; 10 2.857,-2.68; 11 2.857,2.68; 12 2.223,2.68; 13 1.587,2.68; 14 0.953,2.68; 15 0.318,2.68; 16 -0.318,2.68; 17 -0.953,2.68; 18 -1.587,2.68; 19 -2.223,2.68; 20 -2.857,2.68
SOIC-8 = smd 0.61 x 1.702: 1 -1.905,-3.251; 2 -0.635,-3.251; 3 0.635,-3.251; 4 1.905,-3.251; 5 1.905,3.251; 6 0.635,3.251; 7 -0.635,3.251; 8 -1.905,3.251
CRYSTAL-SMD-3.2X2.5 = smd 1.2 x 1.1: 1 -1.175,-0.875; 2 1.175,-0.875; 3 1.175,0.875; 4 -1.175,0.875
FC-12M = smd 0.7 x 1.4: 1 -0.85,0; 2 0.85,0

### Placement (x,y rotation side)
C1  35.84,15.91 180 top
C2  37.88,14.33 0 top
C3  28.17,21.32 180 top
C4  28.14,26.33 180 top
C5  24.5,16.8 0 top
C6  49.4,43.38 0 top
C8  32.81,13.24 270 top
C9  42.03,18.04 180 top
C11  11.72,68.28 0 top
C12  11.66,66.51 0 top
C13  11.62,60.41 0 top
C14  10.02,77.49 180 top
C15  10.02,75.66 180 top
C17  42.96,53.5 0 top
C18  27.87,14.6 180 top
C20  27.91,12.71 180 top
C21  31.32,18.12 270 top
C22  29.78,18.11 270 top
C23  47.17,27.15 0 top
C24  40.84,34.15 0 top
C25  45.19,25.5 0 top
C26  42.03,19.72 180 top
C27  24.49,18.3 180 top
C29  19.68,68.76 0 top
C30  25.54,64.2 0 top
C32  3.01,23.44 270 bottom
C33  4.9,20.48 0 top
C34  4.91,18.95 0 top
C35  19.66,37.94 0 top
C75  13.5,58.04 180 top
D1  28.27,30.82 0 top
D2  21.74,25.43 0 top
D3  15.21,20.04 0 top
D4  8.67,14.65 0 top
D5  50.8,22.86 0 top
D6  50.8,16.51 0 top
D7  50.8,10.16 0 top
D8  50.8,3.81 0 top
D9  73.33,30.82 0 top
D10  79.87,25.43 0 top
D11  86.4,20.04 0 top
D12  92.93,14.65 0 top
D13  73.33,67.99 0 top
D14  79.87,73.38 0 top
D15  86.4,78.77 0 top
D16  92.93,84.16 0 top
D17  50.8,82.3 0 top
D18  50.8,75.95 0 top
D19  50.8,88.65 0 top
D20  50.8,95 0 top
D21  28.27,67.99 0 top
D22  21.74,73.38 0 top
D23  15.21,78.77 0 top
D24  8.67,84.16 0 top
D25  15.71,70.51 180 top
D26  26.79,61.76 0 top
D27  6.22,49.4 0 top
D28  95.38,49.4 0 top
D33  50.8,49.4 0 top
E1  34.19,7.99 180 top
F1  11.64,71.21 0 top
G2  77.47,31.62 0 bottom
IC1  19.77,65.06 180 top
J1  3.44,64.99 270 top
Q1  15.6,73.03 0 top
Q2  13.05,39.27 0 top
Q3  85.11,33.78 0 top
Q4  9.45,39.32 0 top
R1  41.98,21.35 0 top
R2  24.46,19.86 0 top
R3  33.14,31.24 180 top
R4  33.29,29.94 180 top
R5  85.09,37.96 270 top
R6  4.91,29.05 0 top
R7  45.14,23.16 0 top
R8  7.57,30.51 180 top
R9  81.56,32.78 180 top
R10  16.35,37.29 0 top
R11  11.3,41.72 180 top
R12  11.61,73.36 0 top
R13  11.69,64.58 0 top
R14  11.59,62.32 0 top
R15  24.66,61.81 270 top
R16  9.81,36.35 180 top
R17  19.28,46.36 0 top
R18  15.06,40.27 270 top
R19  19.27,48.84 0 top
R20  51.75,42.5 270 top
R21  6.12,52 0 top
R22  95.33,52 0 top
S2  3.41,74.85 270 top
S3  3.17,35.27 270 top
SP1  85.09,37.97 0 bottom
TP1  3.12,25.82 0 bottom
TP2  40.82,27.79 0 top
TP3  8.79,41.31 0 top
U1  7.4,24.76 270 top
U2  36.93,25.06 90 top
U4  19.82,56.54 90 top
U5  37.95,49.93 270 top
Y1  28.16,23.76 90 top
Y2  39.16,18.85 90 top

### Tracks (layer width: path | path; a pad name or v marks a point on that pad's centre or on a via)
3.3V  (via drill 0.35)  (1 unrouted)
  Top 0.152: SP1.P$1 86.75,38.81 R5.1 83,40.91 v72.53,40.91 | v67.48,40.97 65.38,38.87 v55.47,38.87 | v52.9,38.79 51.66,40.03 51.75,40.12 R20.2 | C22.1 | C30.1 24.66,64.17 R15.1 24.16,63.16 IC1.1 22.47,60.46 21.7,59.69 v20.09,58.08 | 51.44,43.67 R20.1 | U2.1 v32.95,20.32 31.59,18.97 C21.1 C22.1 | C22.1 28.38,17.57 | 28.38,17.57 28.38,14.94 C18.1 28.72,12.75 C20.1 | U2.46 33.93,23.6 33.46,23.6 32.85,23 v32.36,23 | U2.43 32.51,24.86 v32.16,24.51 | v35.07,19.95 35.94,20.82 U2.4 U2.3 | U2.37 33.47,27.78 v33.15,27.78 32.44,28.49 R4.2 32.29,30.09 R3.2 | R1.2 43.98,21.35 45.79,23.16 R7.2 45.99,23.85 C25.1 | U2.19 v43.14,25.26 44.11,25.26 C25.1 | U1.2 8.27,26.84 8.27,27.2 8.46,27.39 8.74,27.39 8.88,27.25 v10.8,27.25 | v27.83,18.12 27.86,18.12 28.38,17.59 28.38,17.57 | C34.1 4.06,18.06 v4.37,17.74 | v19.99,52.64 19.99,48.97 R19.2 21.4,47.55 21.4,45.65 18.81,43.06 C35.1 18.57,38.17 16.38,38.17 R10.1 | v36.28,55.43 44.63,55.43 51.58,48.48 51.58,46.34 | v27.26,54.92 23.96,54.92 v23.89,54.84 | C25.1 44.67,25.5 45.4,26.22 C23.1 49.55,30.37 49.55,41.65 50.05,41.65 R20.1 | 51.58,46.34 D33.3 51.44,44.57 C6.2 | 51.58,46.34 51.75,46.17 R20.1
  Bottom 0.152: v72.53,40.91 67.55,40.91 v67.48,40.97 | v55.47,38.87 52.98,38.87 v52.9,38.79 | v32.16,24.51 32.36,24.32 | v27.83,18.12 19.93,18.12 v10.8,27.25 5.08,27.25 4.37,26.54 v4.37,17.74 | v20.09,58.08 20.09,55.36 20.09,52.75 v19.99,52.64 21.69,52.64 v23.89,54.84 | v36.28,55.43 27.77,55.43 v27.26,54.92
  Bottom 0.305: 32.36,24.32 v32.36,23 32.36,20.91 v32.95,20.32 33.32,19.95 v35.07,19.95 36.33,19.95 39.07,22.7 40.58,22.7 v43.14,25.26 | v33.15,27.78 32.16,26.79 v32.16,24.51
3.3V_F
  Top 0.152: C75.1 17.05,58.04 17.11,58.1 | 17.11,58.1 U4.13 | U4.3 22,54.95 18.86,58.1 17.11,58.1 | U4.14 17.14,58.06 17.11,58.1
26M_N
  Top 0.152: U2.44 33.93,24.4 33.49,24.4 33.45,24.36 32.87,24.36 32.41,23.91 28.31,23.91 Y1.3 C4.2
26M_P
  Top 0.152: U2.45 33.05,24.06 32.62,23.62 32.56,23.62 32.54,23.6 30.06,23.6 Y1.1 28.5,22.05 28.38,22.05 28.24,21.91 28.24,21.78 27.77,21.32 C3.2
32K_XN
  Top 0.152: U2.13 40.14,22.6 41.26,22.6 41.98,21.88 41.98,20.4 41.3,19.72 C26.2 41.16,19.7 Y2.2
32K_XP
  Top 0.152: U2.12 39.13,20.92 38.5,20.28 38.36,20.28 38.23,20.15 38.23,18.93 Y2.1 41.14,18 C9.2
36
  Top 0.152: 34.7,15.91 C1.2 35.07,15.91 | 35.18,15.91 35.07,15.91 | U2.5 36.34,17.18 35.07,15.91
37
  Top 0.152: U2.6 36.73,15.96 C1.1
38
  Top 0.152: U2.7 37.13,16.84 37.47,16.51 37.47,14.76 C2.1
39
  Top 0.152: U2.8 37.53,16.87 37.77,16.64 37.77,15.28 C2.2
ACC_INT  (via drill 0.35)
  Top 0.152: U2.14 41.53,23.26 v42.23,22.56 | v53.89,27.06 53.89,45.29 D33.4
  Bottom 0.152: v42.23,22.56 49.4,22.56 v53.89,27.06
AUDIO_IN
  Bottom 0.152: C32.1 3.01,25.71 TP1.P$1
BUZZER_OUT  (via drill 0.35)
  Top 0.152: v72.05,36.03 77.46,36.03 R9.2 | v35.33,29.82 35.53,29.61 U2.34
  Bottom 0.152: v35.33,29.82 65.84,29.82 v72.05,36.03
CA1  (via drill 0.35)
  Top 0.152: D21.P$2 29.02,77.82 v29.84,78.64 | v51.22,80.01 51.22,81.96 D17.P$2 62.89,82.3 v73.07,72.11 | v74.92,69.73 74.92,68.83 D13.P$2 74.08,64.46 v73.57,63.95 | 73.21,30.7 73.97,30.7 D9.P$2 74.13,30.77 | 74.13,30.77 75.22,29.68 v75.5,29.68 | v53.27,22.98 53.15,22.86 D5.P$2 49.85,24.56 v47.39,24.56 | v25.66,27.85 26.05,27.85 D1.P$2 29.78,30.82 v30.7,31.73 | v20.8,26.77 20.99,26.59 D2.P$1 18.83,25.43 14.46,21.05 D3.P$1 13.31,20.04 D4.P$1 7.92,20.06 9.01,21.15 9.35,21.15 9.71,21.5 9.71,22 9.35,22.36 9.01,22.36 U1.21 | v74.81,43.56 77.23,43.56 v78.77,42.02 | v76.28,33.51 76.28,32.93 74.13,30.77 | v41.61,28.93 41.61,30.33 v41.71,30.43
  Bottom 0.152: v29.84,78.64 31.21,80.01 v51.22,80.01 | v74.92,69.73 74.92,70.26 v73.07,72.11 | v75.5,29.68 68.67,22.86 | 68.67,22.86 68.63,22.81 | v53.27,22.98 68.55,22.98 68.67,22.86 | v25.66,27.85 21.87,27.85 v20.8,26.77 | v73.57,63.95 73.57,44.81 v74.81,43.56 | v78.77,42.02 78.77,36 v76.28,33.51 | v47.39,24.56 43.02,28.93 v41.61,28.93 | v30.7,31.73 32.01,30.43 39.42,30.43 39.58,30.26 40.09,30.26 40.25,30.43 v41.71,30.43
CA2  (via drill 0.35)
  Top 0.152: v23.7,74.65 23.7,74.59 D22.P$2 28.13,73.38 v28.2,73.31 | v51.51,77.27 51.51,75.98 D18.P$2 | D14.P$2 81.71,74.47 v81.71,75.21 | D8.P$1 D7.P$1 50.02,10.16 v49.14,11.04 | v53.06,13.38 53.06,15 D6.P$2 50.66,15.62 v50.66,15.2 | D10.P$2 81.91,24.13 v81.91,24.1 | U1.22 9.4,22.74 10.01,22.13 10.01,21.23 v9.09,20.31 | v18.4,18.35 18.4,21.34 D2.P$2 22.49,25.79 D1.P$1 27.92,30.82 28.55,31.44 29.34,31.44 v29.63,31.73 | v33.34,73.1 33.34,57.95 v29.43,54.04 | v26.86,53.21 26.86,51.44 27.39,50.91 27.39,42.09 v26.45,41.16 | v27.27,34.22 27.31,34.17 v30.31,34.17
  Bottom 0.152: v23.7,74.65 26.32,77.27 v51.51,77.27 79.65,77.27 v81.71,75.21 | v49.14,11.04 50.72,11.04 v53.06,13.38 71.19,13.38 v81.91,24.1 | v9.09,20.31 11.04,18.35 v18.4,18.35 19.32,17.43 19.32,17.19 19.68,16.84 47.3,16.84 48.95,15.2 v50.66,15.2 | v28.2,73.31 33.14,73.31 v33.34,73.1 | v29.43,54.04 27.69,54.04 v26.86,53.21 | v27.27,34.22 27.27,37.22 27.39,37.33 27.39,40.22 v26.45,41.16 | v30.31,34.17 29.63,33.49 v29.63,31.73
CA3  (via drill 0.35)
  Top 0.152: v17.44,80.22 17.41,80.22 D23.P$2 17.07,77.66 v17.24,77.66 | v51.05,89.72 51.55,89.22 D19.P$2 | D15.P$2 88.35,79.97 v88.5,79.97 | D5.P$1 D6.P$1 50.05,16.45 | 50.05,16.45 50.05,11.66 D7.P$2 51.58,10.19 v53.35,10.19 | D12.P$1 89.81,14.65 v88.17,16.29 | D11.P$2 88.65,18.53 v88.65,18.49 | U1.23 9.47,23.89 9.84,23.89 10.44,23.29 v10.44,20.37 8.72,18.65 v8.72,18.42 | v15.26,18.99 15.26,19.34 D3.P$2 17.79,18.2 17.79,18.1 18.45,17.44 v19.93,17.44 | v48.33,17.38 49.12,17.38 50.05,16.45
  Bottom 0.152: v17.44,80.22 21.87,84.64 23.84,84.64 28.93,89.72 v51.05,89.72 72.59,89.72 82.35,79.97 v88.5,79.97 | v53.35,10.19 53.43,10.11 69.13,10.11 75.31,16.29 v88.17,16.29 88.65,16.76 v88.65,18.49 | v10.44,20.37 11.81,18.99 v15.26,18.99 | v19.93,17.44 48.27,17.44 v48.33,17.38 | v17.24,77.66 17.24,57.12 13.08,52.96 12.06,52.96 8.59,49.49 8.59,42.3 5.52,39.23 5.52,28.13 4.07,26.67 4.07,18.3 3.76,18 3.76,17.49 4.12,17.14 4.62,17.14 5.91,18.42 v8.72,18.42
CA4  (via drill 0.35)
  Top 0.152: D24.P$2 9.42,84.28 v10.6,85.45 | v50.86,96.12 51.55,95.42 51.55,95.13 | 51.55,95.13 D20.P$2 | D16.P$2 93.68,86.17 93.02,86.83 | 93.02,86.83 v92.97,86.88 | v3.81,13.64 8.42,13.64 D4.P$2 11.26,16.49 v11.26,17.07 | v51.47,2.43 51.47,3.72 D8.P$2 56.51,8.77 v56.51,9 | U1.24 9.47,24.29 9.87,24.29 11.04,23.12 v11.04,21.54 | v92.12,13.36 93.33,13.36 93.84,13.87 93.84,14.49 D12.P$2 93.68,15.39 93.3,15.77 89.91,15.77 D11.P$1 84.5,20.04 D10.P$1 77.97,25.43 D9.P$1 70.86,32.54 70.86,54.82 72.89,56.85 72.89,62.19 75.36,64.65 75.41,64.65 77.41,66.66 v77.41,70.9 | v53.35,95.08 51.61,95.08 51.55,95.13 | v77.35,73.09 91.09,86.83 93.02,86.83
  Bottom 0.152: 51.17,95.8 50.9,96.07 | 50.9,96.07 v50.86,96.12 | v11.04,21.54 10.48,20.98 8.9,20.98 8.48,20.56 8.48,19.85 v11.26,17.07 11.26,14.03 16.56,8.74 23.96,8.74 24.23,9 v56.51,9 69.27,9 75.66,15.38 90.1,15.38 v92.12,13.36 | v10.6,85.45 17.89,92.75 21.74,92.75 25.06,96.07 50.9,96.07 | v92.97,86.88 85.72,86.88 77.53,95.08 v53.35,95.08 | v77.41,70.9 77.41,73.03 v77.35,73.09
CA5  (via drill 0.35)
  Top 0.152: D16.P$1 90.16,84.16 85.65,79.64 D15.P$1 83.62,76.74 81.8,76.74 79.11,74.05 D14.P$1 77.41,71.68 75.05,71.68 72.58,69.21 D13.P$1 72.58,56.97 v56.76,41.15 | 9.47,24.69 U1.25 10.2,24.77 11.84,23.13 12.66,23.13 v18.93,29.4 | v20.87,31.1 22.11,32.34 v31.74,32.34 | v31.82,34.12 31.82,40.69 v32.09,40.96
  Bottom 0.152: v18.93,29.4 20.63,31.1 v20.87,31.1 | v31.74,32.34 31.74,34.04 v31.82,34.12 | v32.09,40.96 56.57,40.96 v56.76,41.15
CA6  (via drill 0.35)
  Top 0.152: D20.P$1 D19.P$1 D17.P$1 50.05,76.04 D18.P$1 50.05,71.85 v32.11,53.91 | U1.26 10.11,25.17 v14.07,29.13 | v15.86,31.71 18.98,34.82 29.83,34.82 30.72,35.72 30.72,48.82 v31.59,49.69
  Bottom 0.152: v14.07,29.13 14.07,29.92 v15.86,31.71 | v31.59,49.69 32.11,50.2 v32.11,53.91
CA7  (via drill 0.35)
  Top 0.152: D24.P$1 13.31,78.77 D23.P$1 14.98,78.24 19.84,73.38 D22.P$1 26.38,67.99 D21.P$1 30.96,64.55 30.96,62.04 28.21,59.3 v28.21,41.1 | U1.27 9.47,25.64 10.04,25.64 12.36,27.95 v12.36,29.53 | v12.36,31.05 17,35.69 v28.13,35.69
  Bottom 0.152: v12.36,29.53 v12.36,31.05 | v28.13,35.69 28.13,41.01 v28.21,41.1
CAP_10N
  Top 0.152: 25.52,18.12 C27.1 | U2.48 31.05,19.92 25.38,19.92 R2.2 25.35,19.83 C27.1 | C5.2 25.35,18.25 C27.1
CHIP_PU  (via drill 0.35)
  Top 0.152: U2.9 37.94,21.61 v38.45,21.09 | v40.04,22 40.49,22 R1.1 | S3.2 5.6,35.27 6.1,34.77 | 6.1,34.77 v6.13,34.73 | Q2.3 13.71,37.67 10.8,34.77 6.1,34.77
  Bottom 0.152: v40.04,22 39.13,21.09 v38.45,21.09 36.39,19.03 21.84,19.03 v6.13,34.73
D+
  Top 0.152: J1.D+ 8.07,64.99 R14.1 10.77,62.29 C13.1
D-
  Top 0.152: J1.D- 9.94,65.64 C12.1 10.81,64.61 R13.1
DST  (via drill 0.35)
  Top 0.152: U2.15 41.88,23.66 42.37,23.16 44.2,23.16 | 44.2,23.16 R7.1 | v44.23,24.25 44.23,23.2 44.2,23.16 | v7.32,29.12 7.4,29.04 U1.4
  Bottom 0.152: v7.32,29.12 9.96,29.12 11.28,27.81 | 11.28,27.82 11.28,27.81 | 11.28,27.81 20.36,18.72 36.52,18.72 38.03,20.24 39.14,20.24 41.62,22.73 41.62,22.81 41.98,23.16 43.15,23.16 v44.23,24.25
DTR  (via drill 0.35)
  Top 0.152: U4.1 19.69,53.69 18.42,52.41 R19.1 18.42,46.38 R17.1 18.43,46.16 17.72,45.45 17.58,45.45 v17.53,45.4 | Q2.1 11.34,39.42 v11.34,39.45
  Bottom 0.152: v11.34,39.45 11.34,42.72 14.01,45.4 v17.53,45.4
FLASH_SCK  (via drill 0.35)
  Top 0.152: U2.31 36.73,31.63 34.28,34.09 34.28,46.52 v34.37,46.62 | v38.98,48.36 39.91,49.3 U5.6
  Bottom 0.152: v34.37,46.62 37.24,46.62 v38.98,48.36
FLASH_SCS  (via drill 0.35)
  Top 0.152: U2.30 37.13,32.17 35.06,34.25 35.06,43.1 v35.12,43.16 | v29.33,45.76 29.33,49.72 31.52,51.91 34.62,51.91 U5.1
  Bottom 0.152: v35.12,43.16 31.94,43.16 v29.33,45.76
FLASH_SDI  (via drill 0.35)
  Top 0.152: v38.42,46.02 40.43,48.03 U5.5 | U2.33 35.94,30.85 32.97,33.82 v32.97,44.59
  Bottom 0.152: 38.39,46.05 v38.42,46.02 35.59,46.02 35.07,45.5 33.88,45.5 v32.97,44.59
FLASH_SDO
  Top 0.152: U5.2 33.75,50.57 33.13,49.94 33.13,45.36 33.6,44.89 33.6,34.02 36.34,31.29 U2.32
FLASH_SHD
  Top 0.152: U2.28 37.94,33.2 39.21,34.47 39.21,34.74 45.31,40.85 45.31,50.16 44.9,50.57 U5.7
FLASH_SWP
  Top 0.152: U2.29 37.53,48.2 36.44,49.3 U5.3
FLASH_VDD
  Top 0.152: C24.1 39.96,34.12 | 42.15,53.46 C17.1 42.11,52.75 U5.8 44.69,51.84 46.14,50.38 46.14,40.31 C24.1 | C24.1 38.73,32.9 U2.26
GND  (via drill 0.35)
  Top 0.152: U2.EP 36.94,24.18 | C33.2 6.19,20.92 6.21,20.92 7.4,22.12 U1.18 | U1.5 7,27.81 R6.2 6.72,30.01 R8.2 4.07,33.16 S3.3 3.04,34.04 2.38,34.7 2.38,35.97 3.54,35.97 S3.1 4.33,36.75 | E1.GND2 37.57,9.28
  Top 0.508: 35.37,9.27 35.38,9.28 36.41,9.28
  Top 0.813: E1.GND 35.37,9.27 | 37.57,9.28 37.56,9.28 | 36.41,9.28 37.57,9.28
  Bottom 0.152: v7.24,35.75 8.68,34.31 v8.68,33.87
  other vias: 35.4,26.39 6.72,24.11 6.77,25.39 8.09,25.39 8,24.12 36.9,26.38 38.51,26.4 35.37,24.63 38.47,24.8 36.92,24.7 35.37,23.57 36.93,23.54 38.5,23.52 25.71,22.88 30.37,22.46 5.46,26.6 30.71,25.34 40.59,28.9
  pour Top (isolate 0.152, rank 2): -0.54,7.93 102.71,7.93 102.71,101.39 -0.54,101.39 -0.54,7.94
  pour Top (isolate 0.152): 35.36,7.77 35.39,7.77 35.39,8.46
  pour Top (isolate 0.152): 37.92,7.79 37.44,7.79 37.44,8.72
  pour Bottom (isolate 0.152, rank 2): -3.96,99.27 106.84,99.27 106.84,7.7 -3.97,7.7 -3.97,99.27
IR_OUT  (via drill 0.35)
  Top 0.152: U2.24 39.88,30.82 v39.84,30.87 | v94.22,55.8 94.35,55.67 94.35,52.13 R22.1 | R21.1 6.06,51.22 6.06,39.21 v6.87,38.4 | v21.01,39.92 v29.37,39.92 v29.38,39.93
  Bottom 0.152: v39.84,30.87 39.92,30.96 | 39.92,30.96 41.42,32.45 66.83,32.45 78.5,44.12 88.24,44.12 92.86,48.75 92.86,54.31 94.22,55.67 v94.22,55.8 | v6.87,38.4 19.49,38.4 v21.01,39.92 | v29.38,39.93 38.35,30.96 39.92,30.96
LEDS_SDB  (via drill 0.35)
  Top 0.152: U2.39 33.93,26.52 33.49,26.52 32.3,27.71 v32.13,27.71 | v23.87,30.3 8.64,30.3 R8.1 8.42,29.36 7.8,28.73 U1.3
  Bottom 0.152: v23.87,30.3 25.71,28.45 25.91,28.45 27.13,27.24 31.18,27.24 31.65,27.71 v32.13,27.71
LNA_IN
  Top 0.203: C8.1 32.81,18.67 33.63,19.49 34.82,20.69 35.13,21 U2.2
N$1
  Top 0.152: C33.1 5.71,22.14 6.34,22.14 6.53,22.33 6.53,22.69 U1.16
N$2
  Top 0.152: 4.06,28.79 R6.1 5.72,27.39 6.34,27.39 6.53,27.2 6.53,26.84 U1.6
N$3
  Top 0.152: Q3.3 85.11,37.09 R5.2 83.45,37.11 SP1.P$2
N$4
  Top 0.152: 23.54,19.93 R2.1 | U2.47 33.93,23.2 33.49,23.2 30.88,20.59 24.67,20.59 24.34,20.59 R2.1 | R2.1 23.64,19.83 C27.2
N$5
  Top 0.152: R21.2 8.12,50.85 D27.A
N$6
  Top 0.152: R22.2 97.28,50.9 D28.A
N$7
  Top 0.152: R13.2 13.28,64.58 18.21,59.66 18.21,59.2 17.77,58.77 U4.12
N$8
  Top 0.152: R14.2 14.22,62.32 U4.11
N$9
  Top 0.152: Q4.2 9.45,36.84 R16.2
N$10  (via drill 0.35)
  Top 0.152: R17.2 17.92,44.15 v16.07,44.15 | v14.12,44.15 13.34,43.38 13.34,40.63 13.33,40.61 13.33,40.46 Q2.5
  Bottom 0.152: v16.07,44.15 v14.12,44.15
N$11  (via drill 0.35)
  Top 0.152: U1.17 6.93,22.69 6.93,22.3 6.46,21.83 6.26,21.83 v5.96,21.53 | v4.98,22.27 3.79,22.27 v2.89,21.38
  Bottom 0.152: v5.96,21.53 5.21,22.27 v4.98,22.27 | v2.89,21.38 2.89,22.47 C32.2
N$12
  Top 0.152: R18.2 14.96,39.32 13.35,39.32 13.05,39.02 Q2.2
N$13  (via drill 0.35)
  Top 0.152: Q4.3 10.1,36.91 R16.1 11.4,37.09 v12.08,37.09 | v13.4,35.73 13.65,35.99 16.11,35.99 17.2,37.08 R10.2
  Bottom 0.152: v12.08,37.09 13.4,35.77 v13.4,35.73
N$14
  Top 0.152: R11.2 9.45,40.72 Q4.5
N$15
  Top 0.152: R11.1 12.15,40.45 Q2.6
N$16  (via drill 0.35)
  Top 0.152: S2.P$2 6.81,74.1 v7.47,73.44
  Bottom 0.152: v7.47,73.44 12.17,73.44 16.99,78.26 17.49,78.26 27.53,68.22 27.53,56.27 23.81,52.55 23.81,38.77 24.81,37.77 G2.+
N$18
  Top 0.152: R15.2 26.71,60.96 D26.A
N$26
  Top 0.152: R9.1 Q3.1
RTS
  Top 0.152: Q2.4 14.13,40.19 R18.1 15.06,44.12 17.45,46.51 17.45,51.16 18.11,51.82 18.11,52.54 19.68,54.11 22.28,54.11 U4.2
SCL  (via drill 0.35)
  Top 0.152: U1.20 8.27,22.69 8.27,22.33 8.46,22.14 8.72,22.14 v9.1,21.75 | v12.45,24.68 15.28,27.51 v15.34,27.51 | v24.54,26.6 26.03,26.6 29.91,30.47 30.98,30.47 v31.01,30.5 | U2.35 35.08,28.07 35.08,28.5 34.81,28.77 v34.81,28.94 34.14,29.61 R4.1
  Bottom 0.152: v9.1,21.75 12.02,24.68 v12.45,24.68 | v24.54,26.6 21.48,26.6 21.05,26.17 16.68,26.17 v15.34,27.51 | v34.81,28.94 32.57,28.94 v31.01,30.5
SDA  (via drill 0.35)
  Top 0.152: U1.19 7.8,21.71 v7.89,21.62 | v11.63,25.36 15.21,28.94 15.38,28.94 v15.38,29.01 | v17.94,31.26 19.88,33.2 31.94,33.2 33.95,31.19 R3.1 33.99,31.16 33.22,30.39 33.22,29.34 33.22,28.65 | 33.23,28.67 33.22,28.65 | 33.22,28.65 33.47,28.41 33.55,28.41 33.94,28.01 U2.36
  Bottom 0.152: v7.89,21.62 v11.63,25.36 | v11.63,25.36 | v15.38,29.01 17.63,31.26 v17.94,31.26
T_B1
  Top 0.152: TP2.TP 40.82,27.15 40.53,26.86 U2.23
T_B2
  Top 0.152: TP3.TP 8.8,41.3 Q4.6
T_DOWN  (via drill 0.35)
  Top 0.152: U2.18 40.55,24.86 40.56,24.87 42.08,24.87 v42.95,24.01 | v50.22,25.5 51.17,26.45 54.15,26.45 67.16,39.46 68.61,39.46 69.47,40.33 69.47,43.83 v69.44,43.87 | v72.1,43.96 83.95,55.81 v83.95,58.82
  Bottom 0.152: v42.95,24.01 43.13,24.01 43.98,24.86 45.72,24.86 47.36,23.22 47.94,23.22 v50.22,25.5 | v69.44,43.87 69.52,43.96 v72.1,43.96 | v83.95,58.82 84.03,58.89 88.8,58.89 88.79,58.9
  pour Bottom: 92.56,59.95 92.56,60.86 arc90 89.25,64.17 88.93,64.17 arc90 85.3,60.54 85.3,56.78 92.51,56.78 92.51,59.89 92.54,59.89 92.54,59.93 92.56,59.93
T_LEFT  (via drill 0.35)
  Top 0.152: U2.22 39.94,26.52 40.62,26.52 48.38,34.28 v48.38,35.46 | v69.49,49.03 68.23,49.03 58.67,39.47 55.22,39.47 54.86,39.12 54.86,35.66 v54.84,35.64 | v71.93,49.09 72.28,49.44 72.28,49.7 89.08,66.5 v90.33,66.5
  Bottom 0.152: v48.38,35.46 48.56,35.64 v54.84,35.64 | v69.49,49.03 71.87,49.03 v71.93,49.09 | v90.33,66.5 94.48,66.5 94.64,66.66
  pour Bottom: 95.17,70.95 94.26,70.95 arc90 90.95,67.64 90.95,67.32 arc90 94.58,63.68 98.34,63.68 98.34,70.89 95.23,70.89 95.23,70.92 95.19,70.92 95.19,70.94
  pour Bottom: 95.17,70.95 94.26,70.95 arc90 90.95,67.64 90.95,67.32 arc90 94.58,63.68 98.34,63.68 98.34,70.89 95.23,70.89 95.23,70.92 95.19,70.92 95.19,70.94
T_RIGHT  (via drill 0.35)
  Top 0.152: U2.20 40.99,25.66 46.48,31.15 v48.06,31.15 | v56.4,31.06 61.6,36.26 61.6,38.22 v61.56,38.26 | v72.57,47.39 82.5,57.33 v82.5,58.16
  Bottom 0.152: v48.06,31.15 56.3,31.15 v56.4,31.06 | v61.56,38.26 70.69,47.39 v72.57,47.39 | v82.5,58.16 82.5,66.05 82.57,66.11
  pour Bottom: 83,63.61 83.91,63.61 arc90 87.22,66.92 87.22,67.24 arc90 83.59,70.87 79.83,70.87 79.83,63.66 82.94,63.66 82.94,63.64 82.98,63.64 82.98,63.62
  pour Bottom: 83.02,63.61 83.6,63.61 arc90 87.24,67.24 arc90 83.6,70.87 79.85,70.87 79.85,63.66 82.96,63.66 82.96,63.64 83,63.64 83,63.62
T_SELECT  (via drill 0.35)
  Top 0.152: U2.17 40.62,24.46 v40.81,24.27 | v44.26,26.7 v45.82,28.27
  Bottom 0.152: v40.81,24.27 43.25,26.7 v44.26,26.7 | v45.82,28.27 73.23,28.27 76.14,31.18 83.87,31.18 83.93,31.18 86.05,31.18 91.03,26.2
  pour Bottom (isolate 0.381): 91.1,32.58 arc-90 97.45,26.23 arc-90 91.1,19.88 arc-90 84.75,26.23 arc-90
T_UP  (via drill 0.35)
  Top 0.152: U2.21 39.94,26.12 40.65,26.12 48.19,33.66 v48.63,33.66 | v72.21,53.66 72.21,55.73 73.19,56.72 73.19,62.01 78.33,67.15 78.33,71.15 79.93,72.75 81.09,72.75 83.35,75.01 v84.74,75.01
  Bottom 0.152: v48.63,33.66 54.46,33.66 68.19,47.39 68.19,51.04 69.59,51.04 v72.21,53.66 | v84.74,75.01 88.89,75.01 88.91,74.99 88.94,75.02 88.94,75.04
  pour Bottom: 85.57,74.57 85.57,73.66 arc90 88.88,70.35 89.2,70.35 arc90 92.84,73.98 92.84,77.74 85.63,77.74 85.63,74.63 85.6,74.63 85.6,74.59 85.58,74.59
  pour Bottom: 85.57,74.57 85.57,73.66 arc90 88.88,70.35 89.2,70.35 arc90 92.84,73.98 92.84,77.74 85.63,77.74 85.63,74.63 85.6,74.63 85.6,74.59 85.58,74.59
TRACE_ANT
  Top 0.305: E1.ANT 34.19,8.8 32.81,10.18 C8.2
U0RXD  (via drill 0.35)
  Top 0.152: U2.40 32.72,26.06 v30.93,27.85 | v17.44,52.73 17.14,53.04 U4.20
  Bottom 0.152: v30.93,27.85 22.49,36.29 22.49,50.37 21.46,51.4 18.78,51.4 v17.44,52.73
U0TXD  (via drill 0.35)
  Top 0.152: U2.41 33.93,25.72 32.2,25.72 30.16,27.76 v30.16,29.86 | v26.93,56.52 26,55.59 U4.4
  Bottom 0.152: v30.16,29.86 23.07,36.96 23.07,52.54 26.93,56.4 v26.93,56.52
V_BATT
  Top 0.152: Q1.3 11.77,77.96 11.77,78.55 11.7,78.63 7.87,78.63 6.35,77.1 S2.P$1
V_USB  (via drill 0.35)
  Top 0.152: Q1.1 13.86,72.03 F1.2 13.09,71.16 | 13.09,71.16 13.74,70.51 13.8,70.51 | 13.8,70.51 D25.A | C14.1 C15.1 12.46,74.07 R12.2 13.09,72.73 13.09,71.16 | U4.15 16.09,56.86 15.54,56.31 v15.54,56.28 | v13.85,69.59 13.8,69.63 13.8,70.51
  Bottom 0.152: v15.54,56.28 13.85,57.97 v13.85,69.59
VIN
  Top 0.152: D25.C 16.93,70.45 | 16.93,70.45 18.61,68.76 C29.1 17.07,67.05 IC1.5 17.59,66.97 18.65,65.91 18.65,64.22 17.59,63.16 IC1.8 | Q1.2 16.93,71.66 16.93,70.45
VUSB-RAW
  Top 0.152: C11.1 | F1.1 10.87,70.59
  Top 0.254: J1.VBUS 8.88,66.29 C11.1 10.87,70.59

### Text on the board
Reference: 39.52
tDocu: Transmitter | Transmitter | Receiver | Receiver | Transmitter | Transmitter